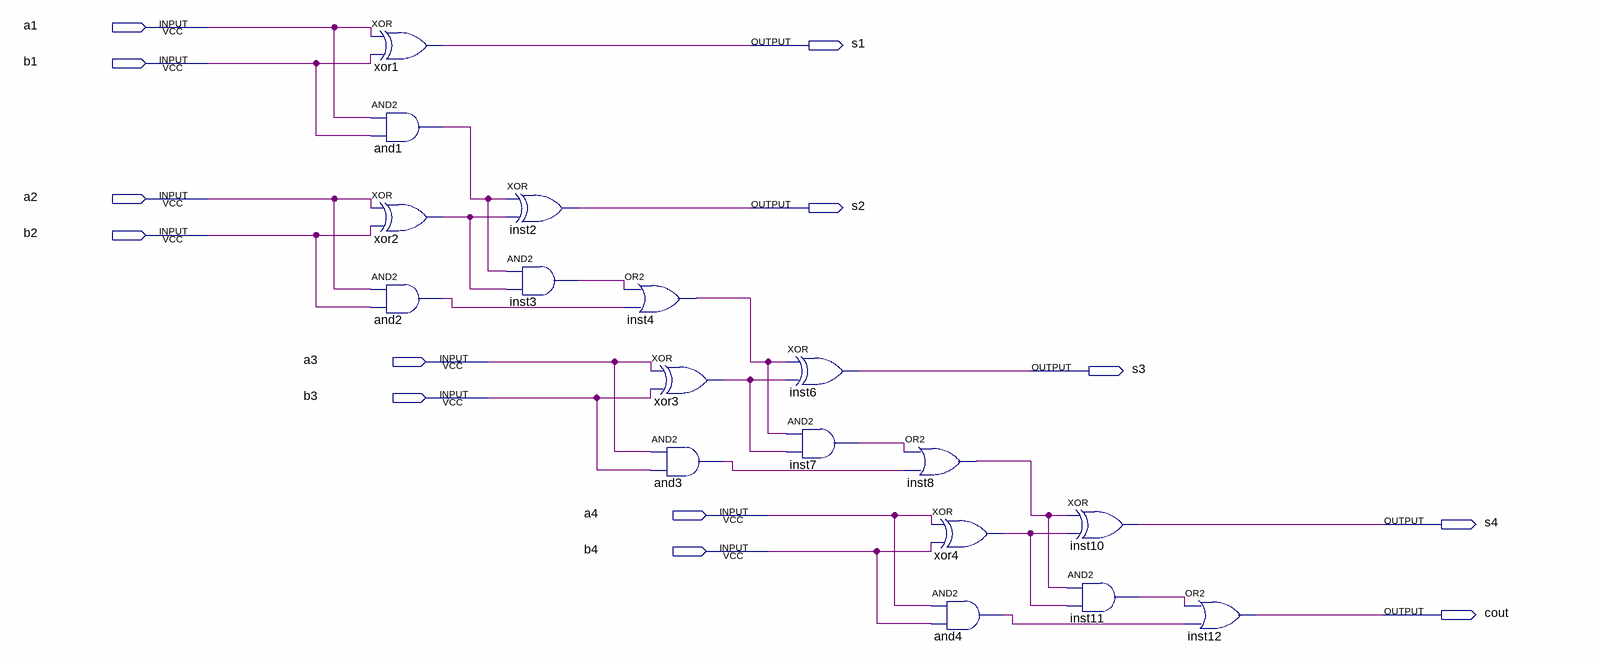
[diagram p0: schematic sheet]
// Quartus schematic adder.bdf as structural Verilog: 17 symbols, 13 pins
module adder (
  input  a1,
  input  b1,
  input  a2,
  input  b2,
  input  a3,
  input  b3,
  input  a4,
  input  b4,
  output s1,
  output s2,
  output s3,
  output s4,
  output cout
);

  wire and1_out, and2_out, and3_out, and4_out, inst3_out, inst4_out, inst7_out, inst8_out, inst11_out,
       xor2_out, xor3_out, xor4_out;

  xor xor1 (s1, a1, b1);
  and and1 (and1_out, a1, b1);
  xor xor2 (xor2_out, a2, b2);
  and and2 (and2_out, a2, b2);
  xor inst2 (s2, and1_out, xor2_out);
  and inst3 (inst3_out, and1_out, xor2_out);
  or inst4 (inst4_out, inst3_out, and2_out);
  xor xor3 (xor3_out, a3, b3);
  and and3 (and3_out, a3, b3);
  xor inst6 (s3, inst4_out, xor3_out);
  and inst7 (inst7_out, inst4_out, xor3_out);
  or inst8 (inst8_out, inst7_out, and3_out);
  xor xor4 (xor4_out, a4, b4);
  and and4 (and4_out, a4, b4);
  xor inst10 (s4, inst8_out, xor4_out);
  and inst11 (inst11_out, inst8_out, xor4_out);
  or inst12 (cout, inst11_out, and4_out);
endmodule
